# EAGLE design ATT-HMC65X (EAGLE 7.2.0)
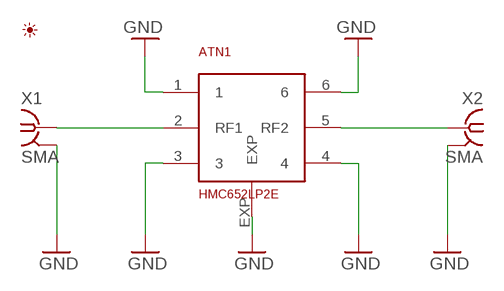
[diagram p0: schematic, sheet 1]

## Parts
ATN1  HMC652LP2E  [DFN-6_LP2]
U$1  PICTO_1  [PICTO_1]
X1  SMA  SMA-142-0701-801/806  [J502-ND-142-0701-801/806]
X2  SMA  SMA-142-0701-801/806  [J502-ND-142-0701-801/806]

## Nets
GND: ATN1.1 ATN1.3 ATN1.4 ATN1.6 ATN1.EXP X1.G@1 X1.G@2 X1.G@3 X1.G@4 X2.G@1 X2.G@2 X2.G@3 X2.G@4
RF1 [RF]: ATN1.2(RF1) X1.1
RF2 [RF]: ATN1.5(RF2) X2.1

## Library data of the parts
ATN1 = Hittite:HMC65: HMC652LP2E HMC653LP2E HMC654LP2E HMC655LP2E HMC656LP2E HMC657LP2E HMC658LP2E WIDEBAND FIXED ATTENUATOR FAMILY, DC - 25 GHz; ATTENUATION: 2 dB
U$1 = My_Picto:PICTO_1: Zdenek Brichacek; OK3ZB; http://blog.brichacek.net
X1 X2 = con-coax:SMA-: SMA 50 Ohm End Launch Jack Receptacle - Round Contact Johnson Components Source: www.johnsoncomponents.com .. J502-ND.pdf; MF: JOHNSON COMPONENTS; MPN: 142-0701-801; OC_FARNELL: 1608592; OC_NEWARK: 90F2624

## Net classes
1 RF: width 2.5 mm, clearance 0.508 mm
2 net: width 0.6 mm, clearance 0.254 mm

## Board
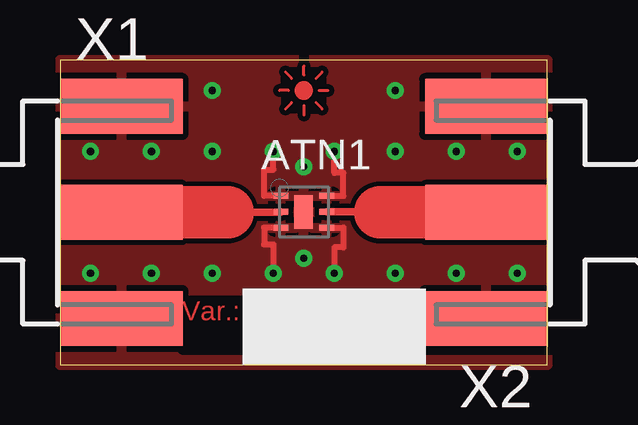
[diagram p1: board, top side]
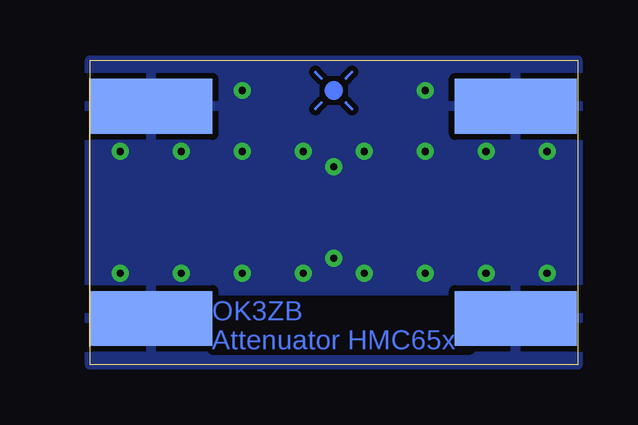
[diagram p2: board, bottom side, seen from below]

Size 20.32 x 12.7 mm. Coordinates in mm from the lower left corner, seen from the top.
Outline: 0,0 20.3,0 20.3,12.7 0,12.7 0,0
Copper layers (1*16): Top 0.035mm / dielectric 1.5mm / Bottom 0.035mm
Design rules "default *": minimum track width 10mil, minimum drill 24mil, track to track 8mil, track to pad 8mil, pad to pad 8mil, via to via 8mil, smd to smd 8mil, copper to edge 0mil, drill to drill 8mil, minimum pad ring 10mil, minimum via ring 8mil, stop-mask expansion 4mil, vias tented up to drill 0mil, thermal gap 10mil

### Footprints (pad centres in the part's own frame; a part is rotated, then mirrored left to right if it is on the bottom)
DFN-6_LP2 = smd 0.61 x 0.254: 1 -0.953,0.686; 2 -0.953,0.025; 3 -0.953,-0.635; 4 0.953,-0.635; 5 0.953,0.025; 6 0.953,0.686 | smd 0.787 x 1.397: EXP -0.013,0.025
J502-ND-142-0701-801/806 = smd 5.08 x 2.286: 1 2.565,0; G@1 2.565,4.42; G@2 2.565,-4.42 | smd 5.08 x 2.286 bottom: G@3 2.565,4.42; G@4 2.565,-4.42

### Placement (x,y rotation side)
ATN1  10.16,6.35 0 top
U$1  10.16,11.43 0 top
X1  0,6.35 0 top
X2  20.32,6.35 180 top

### Tracks (layer width: path | path; a pad name or v marks a point on that pad's centre or on a via)
GND  (via drill 0.3)
  Top 0.254: ATN1.1 8.51,7.04 8.51,8.13 8.89,8.13 v8.89,8.89 | ATN1.3 8.51,5.71 8.51,5.02 8.89,5.02 v8.89,3.81 | ATN1.4 11.81,5.71 11.81,4.89 11.43,4.89 v11.43,3.81 | ATN1.6 11.81,7.04 11.81,8 11.43,8 v11.43,8.89
  other vias: 1.27,8.89 3.81,8.89 6.35,8.89 13.97,8.89 16.51,8.89 19.05,8.89 19.05,3.81 16.51,3.81 13.97,3.81 6.35,3.81 3.81,3.81 1.27,3.81 10.16,8.26 10.16,4.45 6.35,11.43 13.97,11.43
  pour Top: 0,12.7 0,0 20.32,0 20.32,12.7
  pour Bottom: 0,12.7 0,0 20.32,0 20.32,12.7
RF1
  Top 0.305: 6.99,6.35 9.21,6.35 ATN1.2
  Top 2.184: X1.1 6.99,6.35
RF2
  Top 0.305: ATN1.5 12.7,6.38 13.34,6.35
  Top 2.184: 13.34,6.35 X2.1

### Text on the board
Top: Var.:
Bottom: OK3ZB / Attenuator HMC65x